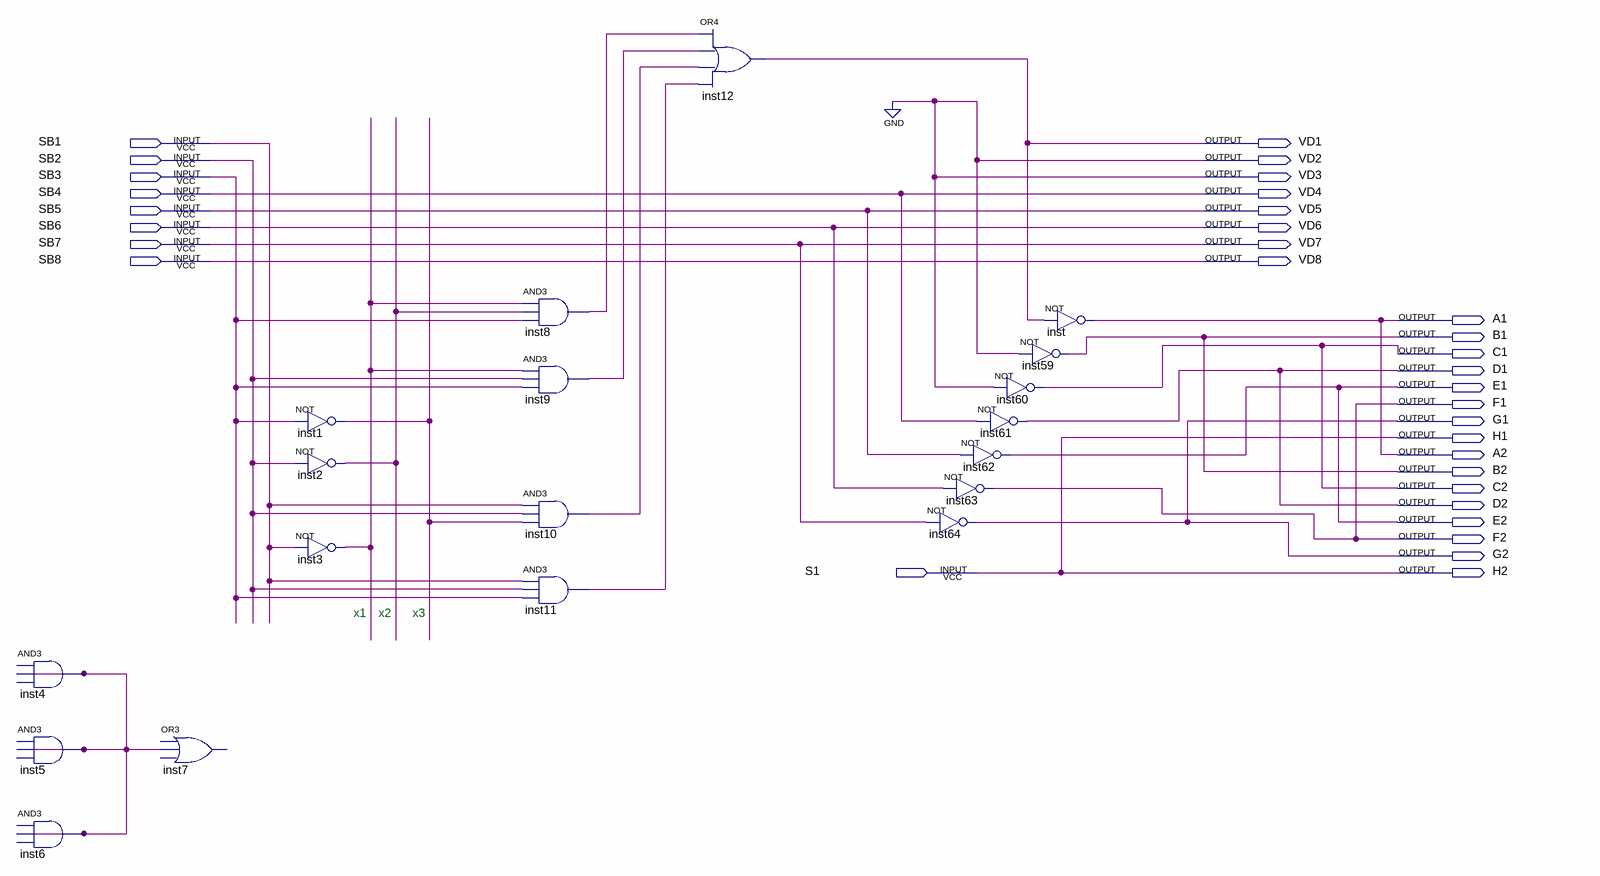
[diagram p0: schematic sheet]
// Quartus schematic Block.bdf as structural Verilog: 19 symbols, 33 pins
module Block (
  input  SB1,
  input  SB2,
  input  SB3,
  input  SB4,
  input  SB5,
  input  SB6,
  input  SB7,
  input  SB8,
  input  S1,
  output VD1,
  output VD2,
  output VD3,
  output VD4,
  output VD5,
  output VD6,
  output VD7,
  output VD8,
  output A1,
  output B1,
  output C1,
  output D1,
  output E1,
  output F1,
  output G1,
  output H1,
  output A2,
  output B2,
  output C2,
  output D2,
  output E2,
  output F2,
  output G2,
  output H2
);

  wire inst1_out, inst2_out, inst3_out, inst4_out, inst8_out, inst9_out, inst10_out, inst11_out;

  // AND3 inst4 has open pins: IN1=open, IN2=open, IN3=open, OUT=inst4_out
  // AND3 inst5 has open pins: IN1=open, IN2=open, IN3=open, OUT=inst4_out
  // AND3 inst6 has open pins: IN1=open, IN2=open, IN3=open, OUT=inst4_out
  // OR3 inst7 has open pins: IN1=open, IN2=inst4_out, IN3=open, OUT=open
  not inst1 (inst1_out, SB3);
  not inst2 (inst2_out, SB2);
  not inst3 (inst3_out, SB1);
  and inst8 (inst8_out, inst3_out, inst2_out, SB3);
  and inst9 (inst9_out, inst3_out, SB2, SB3);
  and inst10 (inst10_out, SB1, SB2, inst1_out);
  and inst11 (inst11_out, SB1, SB2, SB3);
  or inst12 (VD1, inst8_out, inst9_out, inst10_out, inst11_out);
  not inst61 (D1, SB4);
  not inst62 (E1, SB5);
  not inst63 (F1, SB6);
  not inst64 (G1, SB7);
  not inst (A1, VD1);
  not inst59 (B1, 1'b0);
  not inst60 (C1, 1'b0);

  assign A2 = A1;
  assign B2 = B1;
  assign C2 = C1;
  assign D2 = D1;
  assign E2 = E1;
  assign F2 = F1;
  assign G2 = G1;
  assign H1 = S1;
  assign H2 = S1;
  assign VD2 = 1'b0;
  assign VD3 = 1'b0;
  assign VD4 = SB4;
  assign VD5 = SB5;
  assign VD6 = SB6;
  assign VD7 = SB7;
  assign VD8 = SB8;

  // Notes on the sheet:
  //   x1
  //   x2
  //   x3
endmodule
